# Altium project Meshtastic.PrjPcb
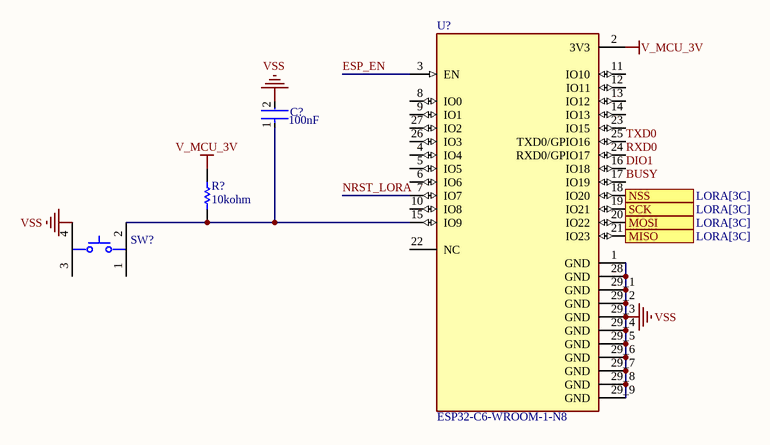
[diagram p0: ESP32.SchDoc]
4 sheets, 51 parts. Net scope: flat (ports and power ports of the same name join across sheets).
Sheets:
  ESP32.SchDoc
  GPS.SchDoc
  LORA.SchDoc
  POWER.SchDoc

## Sheet ESP32.SchDoc
size A4; SheetNumber: 1; SheetTotal: 4

### Parts
(Parts that share a designator on the sheet are numbered #1, #2 ... from top to bottom, then left to right.)
C?#1  Capacitance: 100nF  [FP-CL21-IPC_B]
R?#1  Resistance: 10kohm  [RESC2013X60X35ML10T20]  (hidden comment: RC0805JR-0710KL)
SW?  TL3305CF160QG  [FP-TL3305CF160QG-MFG]  (value not drawn)
U?  ESP32-C6-WROOM-1-N8  [XCVR_ESP32-C6-WROOM-1-N8]

### Ports
MISO (out, see LORA[3C]), MOSI (in, see LORA[3C]), NSS (in, see LORA[3C]), SCK (in, see LORA[3C])

### Nets
V_MCU_3V: R?#1.2 U?.2(3V3)
VSS: C?#1.2 SW?.4 U?.1(GND) U?.28(GND) U?.29_1(GND) U?.29_2(GND) U?.29_3(GND) U?.29_4(GND) U?.29_5(GND) U?.29_6(GND) U?.29_7(GND) U?.29_8(GND) U?.29_9(GND)
BUSY: U?.17(IO19)
DIO1: U?.16(IO18)
ESP_EN: U?.3(EN)
NRST_LORA: U?.7(IO7)
RXD0: U?.24(RXD0/GPIO17)
TXD0: U?.25(TXD0/GPIO16)
NetC?#1_1: C?#1.1 R?#1.1 SW?.2 U?.15(IO9)
NetIC?#1_16: U?.21(IO23) ; port MISO
NetIC?#1_17: U?.20(IO22) ; port MOSI
NetIC?#1_18: U?.19(IO21) ; port SCK
NetIC?#1_19: U?.18(IO20) ; port NSS

Not connected (* = marked no-connect by the designer): SW? 1 3; U? 4(IO4) 5(IO5) 6(IO6) 8(IO0) 9(IO1) 10(IO8) 11(IO10) 12(IO11) 13(IO12) 14(IO13) 22(NC) 23(IO15) 26(IO3) 27(IO2)

### Library data of the parts
C?#1 = CMP-13271-004652-1: CL21 Series 0805 100nF 50V ±10% Tolerance X7R Multilayer Ceramic Chip Capacitor; Voltage Rating (DC): 50V; Packaging: Tape and Reel; Voltage Rating: 50V; Max Operating Temperature: 125°C; Width: 0.049inch; Thickness: 0.053inch; Dielectric: X7R; Construction: Flat; Series: CL; Radiation Hardening: No; Mount: Surface Mount; Length: 2mm; Contact Plating: Tin; RoHS Compliant: Yes; Case/Package: 0805; Min Operating Temperature: -55°C; Tolerance: 10%; Lead Free: Lead Free; Height: 1.25mm; Depth: 1.25mm; Package Quantity: 10000
R?#1 = CMP-2000-05025-1: Chip Resistor, 10 KOhm, +/- 5%, 0.125 W, -55 to 155 degC, 0805 (2012 Metric), RoHS, Tape and Reel; Manufacturer: Yageo; Resistor Element Type: ThickFilm; Voltage Rating: 150V; Product Range: RCSeries; SVHC: ToBeAdvised; Resistor Case Style: 0805[2012Metric]; Temperature Coefficient: ±100ppm/degC; Power Rating: 250mW; Automotive Qualification Standard: -; Datasheet Version: REV. 2, 09/2004; Packaging: CutTape; Resistance Tolerance: ±5%; MSL: MSL1-Unlimited; Manufacturer URL: http://www.yageo.com/; Datasheet URL: http://www.yageo.ru/pdf/RC0805.pdf; Package Description: 2-Pin Surface Mounted Device, Body 2 x 1.25 mm; Package Reference: 805
SW? = CMP-17879-000011-1: SWITCH TACTILE SPST-NO 50MA 12V; Actuator Type: Standard; Illumination Type: Non-Illuminated; Mechanical Life: 500000Cycles; Switch Function: Off-Mom; Switch Travel: 0.2mm; Operating Force: 160gf; Throw Configuration: SPST; Lead Free: Lead Free; Packaging: Tape and Reel; Termination: Gull Wing; Max Operating Temperature: 70°C; Min Operating Temperature: -20°C; Mount: Surface Mount
U? = ESP32-C6-WROOM-1-N8: Multiprotocol Modules ESP32-C6 module, Wi-Fi 6 in 2.4 GHz band, Bluetooth 5, Zigbee 3.0 and Thread. ESP34-WROOM Compatible - ENGINEERING SAMPLE; MF: Espressif Systems; SnapEDA_Link: https://www.snapeda.com/parts/ESP32-C6-WROOM-1-N8/Espressif+Systems/view-part/?ref=snap; Package: SMD-28 Espressif Systems; Value: *; MP: ESP32-C6-WROOM-1-N8; Check_prices: https://www.snapeda.com/parts/ESP32-C6-WROOM-1-N8/Espressif+Systems/view-part/?ref=eda

## Sheet GPS.SchDoc
size A4; SheetNumber: 2; SheetTotal: 4
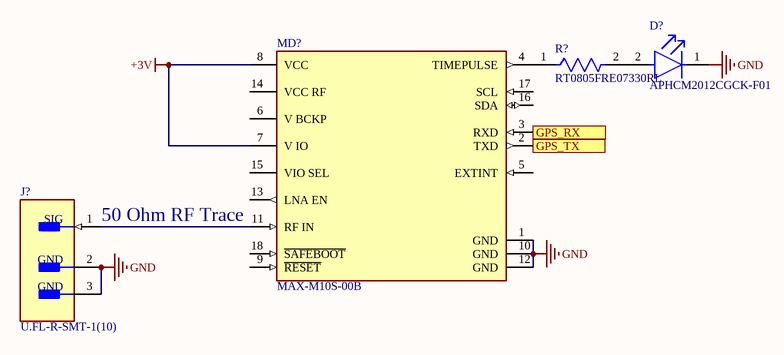
[diagram p1: GPS.SchDoc]

### Parts
(Parts that share a designator on the sheet are numbered #1, #2 ... from top to bottom, then left to right.)
D?#1  APHCM2012CGCK-F01  [FP-APHCM2012CGCK-F01-MFG]
J?#1  U.FL-R-SMT-1(10)  [FP-U_FL-R-SMT-1_10-MFG]
MD?  MAX-M10S-00B  [FP-MAX-M10S-00B-MFG]
R?#2  RT0805FRE07330RL  [FP-RT0805-MFG]

### Ports
GPS_RX (in), GPS_TX (out)

### Nets
+3V: MD?.7(V_IO) MD?.8(VCC)
GND: D?#1.1(C) J?#1.2(GND) J?#1.3(GND) MD?.1(GND) MD?.10(GND) MD?.12(GND)
NetD?#1_2: D?#1.2(A) R?#2.2
NetJ?#1_1: J?#1.1(SIG) MD?.11(RF_IN)
NetMD?_2: MD?.2(TXD) ; port GPS_TX
NetMD?_3: MD?.3(RXD) ; port GPS_RX
NetMD?_4: MD?.4(TIMEPULSE) R?#2.1

Not connected (* = marked no-connect by the designer): MD? 5(EXTINT) 6(V_BCKP) 9(~{RESET}) 13(LNA_EN) 14(VCC_RF) 15(VIO_SEL) 16(SDA) 17(SCL) 18(~{SAFEBOOT})

### Notes on the sheet
- 50 Ohm RF Trace

### Library data of the parts
D?#1 = CMP-44529-000062-1: LED GREEN CLEAR CHIP SMD; Dominant Wavelength: 570nm; Forward Current: 20mA; Number of LEDs: 1; Luminous Intensity: 40mcd; Forward Voltage: 2.1V; Viewing Angle: 110°; Illumination Color: Green; Lens Style: Clear; Mount: Surface Mount; Length: 2mm; Max Operating Temperature: 85°C; Series: APHCM; Width: 1.25mm; Lead Free: Lead Free; Wavelength: 570nm; Package Quantity: 1; Number of Pins: 2; Case Code (Metric): 2012; RoHS Compliant: Yes; Packaging: Tape and Reel; Lens Color: Clear; Case/Package: 0805; Case Code (Imperial): 0805; Test Current: 20mA; Color: Green; Min Operating Temperature: -40°C; Height: 0.4mm
J?#1 = CMP-2000-05152-3: CONN U.FL RCPT STR 50 OHM SMD; Max Frequency: 6GHz; Connector Type: Coaxial; Body Plating: Silver; Body Material: Bronze; Impedance: 50R; Dielectric Material: Polymer; Insulation Resistance: 500MR; Gender: Male; Packaging: Cut Tape; Length: 3mm; Package Quantity: 2500; Termination: Solder; Lead Free: Lead Free; Series: U.FL; Min Operating Temperature: -40°C; Fastening Type: Snap; Contact Material: Brass; Orientation: Straight; Wire/Cable Type: Coaxial; Frequency: 6GHz; Contact Plating: Gold; Depth: 3.1mm; Weight: 0.001764oz; Max Operating Temperature: 90°C; Radiation Hardening: No; REACH SVHC: No SVHC; Mount: Surface Mount; Housing Color: Beige
MD? = CMP-207130-000026-1: GNSS LCC RX, ROM, TCXO, LNA, SAW
R?#2 = CMP-03412-000042-1: Res Thin Film 0805 330K Ohm 1% 1/8W ±50ppm/°C Molded SMD SMD Paper T/R; Manufacturer: Yageo; Resistance: 330Ω; Value: 330Ω; Power Rating: 0.125W; Tolerance: 0.0001; Voltage Rating: 150V; Manufacturer Part Number: RT0805FRE07330RL; Height: 0.6mm; Octopart: https://octopart.com/rt0805fre07330rl-yageo-39785396; Package: RT0805; Temperature: -55°C to +155°C; Category: Res; RoHS: TRUE; ComponentLink2Description: Datasheet; Automotive: No; Device Class L3: Chip SMD Resistors; Temperature Range High: +155°C; Device Class L1: Passive Components; Temperature Coefficient: 50 ppm/°C; Series: RT; Composition: Thin Film; Digikey Description: Res Thin Film 0805 330K Ohm 1% 1/8W ±50ppm/°C Molded SMD SMD Paper T/R; Mouser Description: Res Thin Film 0805 330K Ohm 1% 1/8W ±50ppm/°C Molded SMD SMD Paper T/R; Device Class L2: Resistors; Temperature Range Low: -55°C; Ipc Land Pattern Name: RESC200125X50; Lead Free: Yes; ComponentLink2URL: http://www.yageo.com/documents/recent/PYu-RT_1-to-0.01_RoHS_L_9.pdf; Footprint Url: http://www.yageo.com/exep/pages/download/literatures/PYu-R_Mount_10.pdf

## Sheet LORA.SchDoc
size A4; SheetNumber: 3; SheetTotal: 4
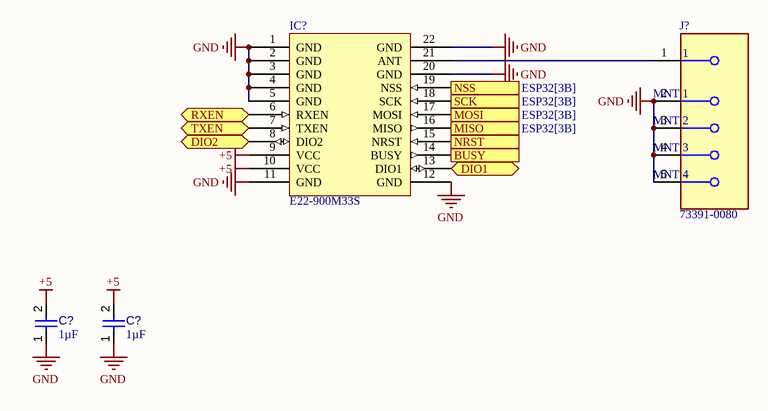
[diagram p2: LORA.SchDoc]

### Parts
(Parts that share a designator on the sheet are numbered #1, #2 ... from top to bottom, then left to right.)
C?#2  value 1µF  [CAPC2013X135X45NL10T25]  (hidden comment: Capacitor 1 uF +/- 10% 50 V 0805)
C?#3  value 1µF  [CAPC2013X135X45NL10T25]  (hidden comment: Capacitor 1 uF +/- 10% 50 V 0805)
IC?#1  E22-900M33S  [E22-XXXM33S]
J?#2  73391-0080  [FP-73391-0080-MFG]

### Ports
BUSY (out), DIO1 (bidir), DIO2 (bidir), MISO (out, see ESP32[3B]), MOSI (in, see ESP32[3B]), NRST (in), NSS (in, see ESP32[3B]), RXEN (bidir), SCK (in, see ESP32[3B]), TXEN (bidir)

### Nets
+5: C?#2.2 C?#3.2 IC?#1.9(VCC) IC?#1.10(VCC)
GND: C?#2.1 C?#3.1 IC?#1.1(GND) IC?#1.2(GND) IC?#1.3(GND) IC?#1.4(GND) IC?#1.5(GND) IC?#1.11(GND) IC?#1.12(GND) IC?#1.20(GND) IC?#1.22(GND) J?#2.2(MNT_1) J?#2.3(MNT_2) J?#2.4(MNT_3) J?#2.5(MNT_4)
NetIC?#1_6: IC?#1.6(RXEN) ; port RXEN
NetIC?#1_7: IC?#1.7(TXEN) ; port TXEN
NetIC?#1_8: IC?#1.8(DIO2) ; port DIO2
NetIC?#1_13: IC?#1.13(DIO1) ; port DIO1
NetIC?#1_14: IC?#1.14(BUSY) ; port BUSY
NetIC?#1_15: IC?#1.15(NRST) ; port NRST
NetIC?#1_16: IC?#1.16(MISO) ; port MISO
NetIC?#1_17: IC?#1.17(MOSI) ; port MOSI
NetIC?#1_18: IC?#1.18(SCK) ; port SCK
NetIC?#1_19: IC?#1.19(NSS) ; port NSS
NetIC?#1_21: IC?#1.21(ANT) J?#2.1

### Library data of the parts
C?#2 C?#3 = CMP-001-00007-6: Chip Capacitor, 1 uF, +/- 10%, 50 V, 0805 (2012 Metric); Capacitor Type: Ceramic; Voltage Rating: 50V; Min Operating Temperature: -55°C; RoHS Compliant: True; Mounting Technology: SM; Case/Package: 0805; Max Operating Temperature: 125°C; Tolerance: 10%; Pins: 2
J?#2 = CMP-00257-00776539-1: 73391-0080 RF Connector, SMA RA JACK PCB 73391 SMA RF Connectors Series; Manufacturer Lifecycle Status: ACTIVE; NexarPartId: 776539; Max Frequency: 18GHz; Polarity: Standard; Impedance: 50Ω; Connector Type: Coaxial, SMA; Body Material: Zinc; Body Plating: Nickel; REACH SVHC: Unknown; Contact Plating: Gold; Radiation Hardening: No; Mount: Through Hole; Depth: 6.35mm; Length: 14.8mm; Case/Package: SMA; Lifecycle Status: Production; Contact Material: Copper; Orientation: Right Angle; Termination: Solder; Insulation Material: Teflon; Frequency: 18GHz; RoHS: Compliant; Country of Origin: TW; Halogen Free: Low Halogen; Plating: Nickel

## Sheet POWER.SchDoc
size A4; SheetNumber: 4; SheetTotal: 4
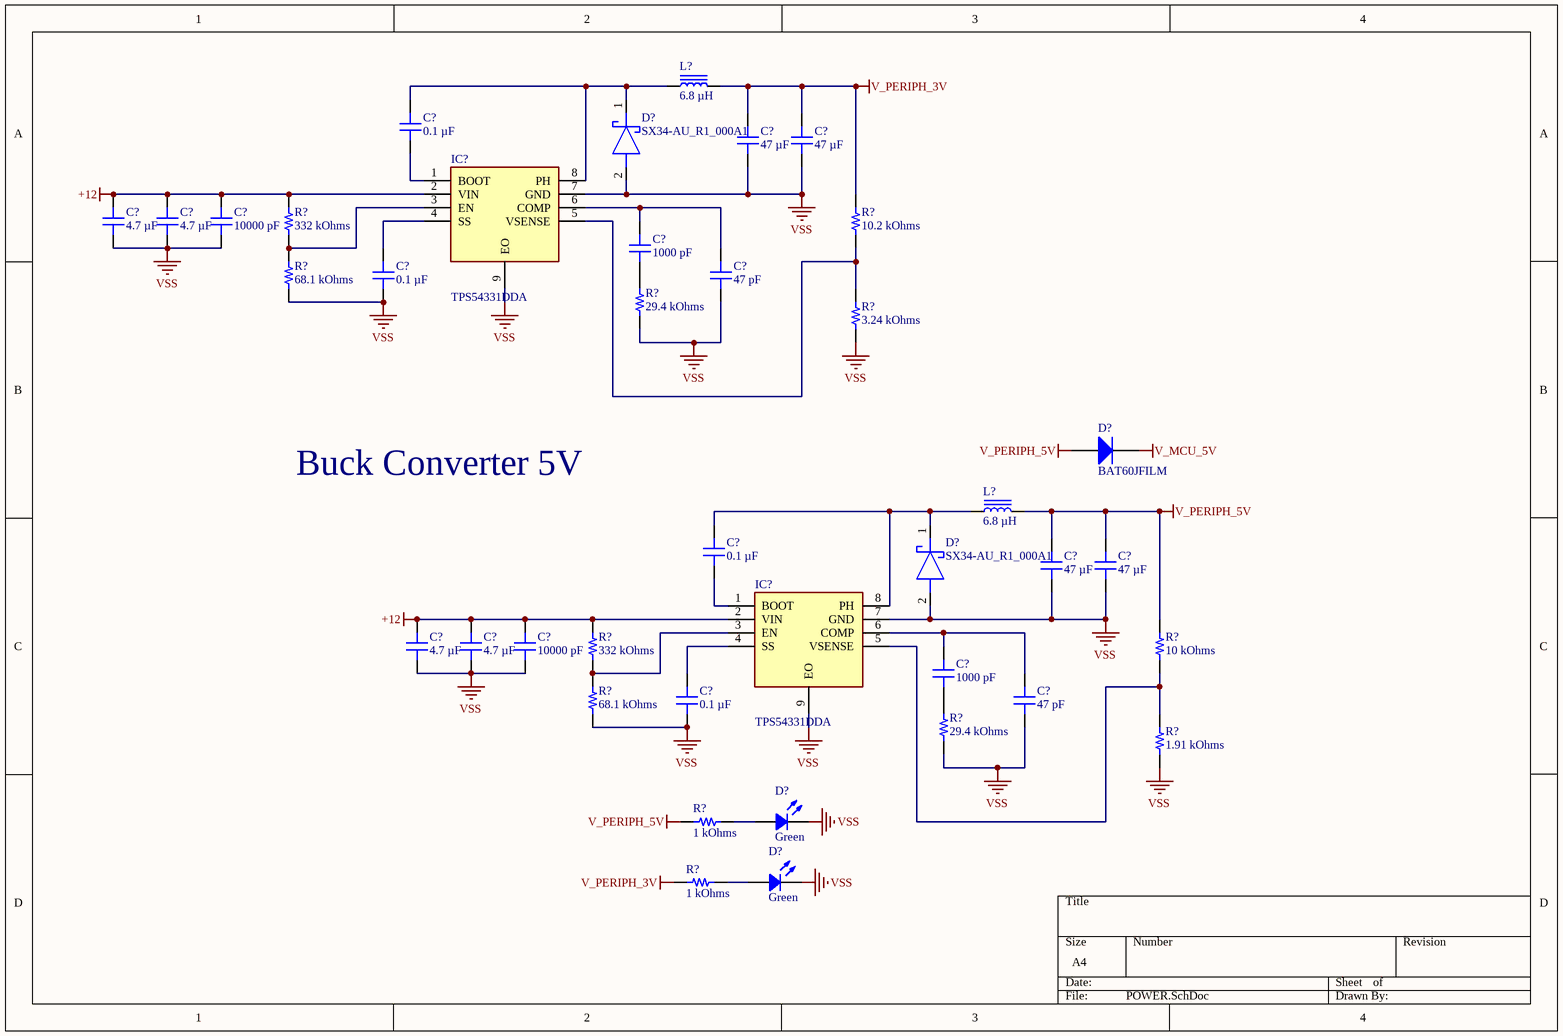
[diagram p3: POWER.SchDoc]

### Parts
(Parts that share a designator on the sheet are numbered #1, #2 ... from top to bottom, then left to right.)
C?#4  0.1 µF  [CAP 1206_3216 - 0.8MM]
C?#5  47 µF  [CAP 1206_3216 - 0.8MM]
C?#6  47 µF  [CAP 1206_3216 - 0.8MM]
C?#7  4.7 µF  [CAP 1206_3216 - 0.8MM]
C?#8  4.7 µF  [CAP 1206_3216 - 0.8MM]
C?#9  10000 pF  [CAP 1206_3216 - 0.8MM]
C?#10  1000 pF  [CAP 1206_3216 - 0.8MM]
C?#11  0.1 µF  [CAP 1206_3216 - 0.8MM]
C?#12  47 pF  [CAP 1206_3216 - 0.8MM]
C?#13  0.1 µF  [CAP 1206_3216 - 0.8MM]
C?#14  47 µF  [CAP 1206_3216 - 0.8MM]
C?#15  47 µF  [CAP 1206_3216 - 0.8MM]
C?#16  4.7 µF  [CAP 1206_3216 - 0.8MM]
C?#17  4.7 µF  [CAP 1206_3216 - 0.8MM]
C?#18  10000 pF  [CAP 1206_3216 - 0.8MM]
C?#19  1000 pF  [CAP 1206_3216 - 0.8MM]
C?#20  0.1 µF  [CAP 1206_3216 - 0.8MM]
C?#21  47 pF  [CAP 1206_3216 - 0.8MM]
D?#2  SX34-AU_R1_000A1  [DIOM5027X244N]
D?#3  BAT60JFILM  [SOD323$2F$A]
D?#4  SX34-AU_R1_000A1  [DIOM5027X244N]
D?#5  Green  [LED 0805_2012 GREEN]
D?#6  Green  [LED 0805_2012 GREEN]
IC?#2  TPS54331DDA  [SOIC127P600X170-9N]
IC?#3  TPS54331DDA  [SOIC127P600X170-9N]
L?#1  6.8 µH  [TDK SLF10165]
L?#2  6.8 µH  [TDK SLF10165]
R?#3  332 kOhms  [RES 1206_3216]
R?#4  10.2 kOhms  [RES 1206_3216]
R?#5  68.1 kOhms  [RES 1206_3216]
R?#6  29.4 kOhms  [RES 1206_3216]
R?#7  3.24 kOhms  [RES 1206_3216]
R?#8  332 kOhms  [RES 1206_3216]
R?#9  10 kOhms  [RES 1206_3216]
R?#10  68.1 kOhms  [RES 1206_3216]
R?#11  29.4 kOhms  [RES 1206_3216]
R?#12  1.91 kOhms  [RES 1206_3216]
R?#13  1 kOhms  [RES 0805_2012]
R?#14  1 kOhms  [RES 0805_2012]

### Nets
+12: C?#7.2 C?#8.2 C?#9.2 C?#16.2 C?#17.2 C?#18.2 IC?#2.2(VIN) IC?#3.2(VIN) R?#3.2 R?#8.2
V_MCU_5V: D?#3.2(K)
V_PERIPH_3V: C?#5.2 C?#6.2 L?#1.2 R?#4.2 R?#14.2
V_PERIPH_5V: C?#14.2 C?#15.2 D?#3.1(A) L?#2.2 R?#9.2 R?#13.2
VSS: C?#5.1 C?#6.1 C?#7.1 C?#8.1 C?#9.1 C?#11.1 C?#12.1 C?#14.1 C?#15.1 C?#16.1 C?#17.1 C?#18.1 C?#20.1 C?#21.1 D?#2.2(A) D?#4.2(A) D?#5.2 D?#6.2 IC?#2.7(GND) IC?#2.9(EO) IC?#3.7(GND) IC?#3.9(EO) R?#5.1 R?#6.1 R?#7.1 R?#10.1 R?#11.1 R?#12.1
NetC?#4_1: C?#4.1 IC?#2.1(BOOT)
NetC?#4_2: C?#4.2 D?#2.1(K) IC?#2.8(PH) L?#1.1
NetC?#10_1: C?#10.1 R?#6.2
NetC?#10_2: C?#10.2 C?#12.2 IC?#2.6(COMP)
NetC?#11_2: C?#11.2 IC?#2.4(SS)
NetC?#13_1: C?#13.1 IC?#3.1(BOOT)
NetC?#13_2: C?#13.2 D?#4.1(K) IC?#3.8(PH) L?#2.1
NetC?#19_1: C?#19.1 R?#11.2
NetC?#19_2: C?#19.2 C?#21.2 IC?#3.6(COMP)
NetC?#20_2: C?#20.2 IC?#3.4(SS)
NetD?#5_1: D?#5.1 R?#13.1
NetD?#6_1: D?#6.1 R?#14.1
NetIC?#2_3: IC?#2.3(EN) R?#3.1 R?#5.2
NetIC?#2_5: IC?#2.5(VSENSE) R?#4.1 R?#7.2
NetIC?#3_3: IC?#3.3(EN) R?#8.1 R?#10.2
NetIC?#3_5: IC?#3.5(VSENSE) R?#9.1 R?#12.2

### Notes on the sheet
- Buck Converter 5V

### Library data of the parts
C?#4 C?#11 C?#13 C?#20 = C1206C104K8RACTU: CAP CER 0.1UF 10V X7R 1206; manufacturer: KEMET; Tolerance: ±10%; Part Number: C1206C104K8RACTU; Capacitance: 0.1 µF; Applications: Bypass, Decoupling; componentlink1description: Datasheet; componentlink1url: https://search.kemet.com/download/datasheet/C1206C104K8RAC7800; componentlink2description: DigiKey Link; componentlink2url: https://www.digikey.com/en/products/detail/kemet/C1206C104K8RACTU/2215080; Device Package: 1206 (3216 Metric); lastupdated: 6.04.2026 7:35:59 ÖS; Lifecycle Status: Active; Minimum Order: 1; Mounting Type: Surface Mount, MLCC; Operating Temperature: -55°C ~ 125°C; Package / Case: 1206 (3216 Metric); packaging: TapeAndReel; partid: 76594; price: 0.08; series: SMD Comm X7R; Size / Dimension: 0.126" L x 0.063" W (3.20mm x 1.60mm); Supplier 1: DigiKey; Supplier Part Number 1: 399-C1206C104K8RACTUCT-ND; Temperature Coefficient: X7R; Thickness (Max): 0.035" (0.88mm); value: 0.1 µF; Voltage - Rated: 10V
C?#5 C?#6 C?#14 C?#15 = GMC31X5R476M16NT: CAP1206 X5R 47UF 20% 16V; manufacturer: Cal-Chip Electronics, Inc.; Part Number: GMC31X5R476M16NT; Capacitance: 47 µF; Applications: General Purpose; componentlink1description: Datasheet; componentlink1url: https://88ce57.p3cdn1.secureserver.net/wp-content/uploads/2023/01/gmc_series-2.pdf; componentlink2description: DigiKey Link; componentlink2url: https://www.digikey.com/en/products/detail/cal-chip-electronics-inc/GMC31X5R476M16NT/18151145; Device Package: 1206 (3216 Metric); lastupdated: 6.04.2026 7:36:39 ÖS; Lifecycle Status: Active; Minimum Order: 1; Mounting Type: Surface Mount, MLCC; Operating Temperature: -55°C ~ 85°C; Package / Case: 1206 (3216 Metric); packaging: TapeAndReel; partid: 49864; Part Status: Active; price: 0.19; series: GMC; Size / Dimension: 0.126" L x 0.063" W (3.20mm x 1.60mm); Supplier 1: DigiKey; Supplier Part Number 1: 4713-GMC31X5R476M16NTCT-ND; Temperature Coefficient: X5R; Thickness (Max): 0.071" (1.80mm); Tolerance: ±20%; value: 47 µF; Voltage - Rated: 16V
C?#7 C?#8 C?#16 C?#17 = GMC31X5R475K16NT: CAP1206 X5R 4.7UF 10% 16V; manufacturer: Cal-Chip Electronics, Inc.; Part Number: GMC31X5R475K16NT; Capacitance: 4.7 µF; Applications: General Purpose; componentlink1description: Datasheet; componentlink1url: https://calchip.com/wp-content/uploads/2025/05/GMC-Series-3.pdf; componentlink2description: DigiKey Link; componentlink2url: https://www.digikey.com/en/products/detail/cal-chip-electronics-inc/GMC31X5R475K16NT/25974971; Device Package: 1206 (3216 Metric); lastupdated: 6.04.2026 7:35:39 ÖS; Lifecycle Status: Active; Minimum Order: 1; Mounting Type: Surface Mount, MLCC; Operating Temperature: -55°C ~ 85°C; Package / Case: 1206 (3216 Metric); packaging: TapeAndReel; partid: 75053; price: 0.04; series: GMC; Size / Dimension: 0.126" L x 0.063" W (3.20mm x 1.60mm); Supplier 1: DigiKey; Supplier Part Number 1: 4713-GMC31X5R475K16NTCT-ND; Temperature Coefficient: X5R; Thickness (Max): 0.075" (1.90mm); Tolerance: ±10%; value: 4.7 µF; Voltage - Rated: 16V
C?#9 C?#18 = C1206C103J4REC7210: CAP CER 1206 10NF 16V X7R 5%; manufacturer: KEMET; Part Number: C1206C103J4REC7210; Capacitance: 10000 pF; Applications: ESD Protection; componentlink1description: Datasheet; componentlink1url: https://connect.kemet.com:7667/gateway/IntelliData-ComponentDocumentation/1.0/download/datasheet/C1206C103J4REC7210; componentlink2description: DigiKey Link; componentlink2url: https://www.digikey.com/en/products/detail/kemet/C1206C103J4REC7210/8645452; Device Package: 1206 (3216 Metric); lastupdated: 6.04.2026 7:36:20 ÖS; Lifecycle Status: Active; Minimum Order: 1; Mounting Type: Surface Mount, MLCC; Operating Temperature: -55°C ~ 125°C; Package / Case: 1206 (3216 Metric); packaging: TapeAndReel; partid: 59936; price: 0.03; series: ESD SMD Comm X7R; Size / Dimension: 0.126" L x 0.063" W (3.20mm x 1.60mm); Supplier 1: DigiKey; Supplier Part Number 1: 399-C1206C103J4REC7210CT-ND; Temperature Coefficient: X7R; Thickness (Max): 0.035" (0.88mm); Tolerance: ±5%; value: 10000 pF; Voltage - Rated: 16V
C?#10 C?#19 = GMC31CG102J50NT: CAP1206 COG 1000PF 5% 50V; manufacturer: Cal-Chip Electronics, Inc.; Temperature Coefficient: C0G, NP0; Part Number: GMC31CG102J50NT; Capacitance: 1000 pF; Applications: General Purpose; componentlink2description: DigiKey Link; componentlink2url: https://www.digikey.com/en/products/detail/cal-chip-electronics-inc/GMC31CG102J50NT/25893179; Device Package: 1206 (3216 Metric); lastupdated: 6.04.2026 7:35:48 ÖS; Lifecycle Status: Active; Minimum Order: 1; Mounting Type: Surface Mount, MLCC; Operating Temperature: -55°C ~ 125°C; Package / Case: 1206 (3216 Metric); packaging: TapeAndReel; partid: 75870; price: 0.03; series: GMC; Size / Dimension: 0.126" L x 0.063" W (3.20mm x 1.60mm); Supplier 1: DigiKey; Supplier Part Number 1: 4713-GMC31CG102J50NTCT-ND; Thickness (Max): 0.039" (1.00mm); Tolerance: ±5%; value: 1000 pF; Voltage - Rated: 50V
C?#12 C?#21 = GMC31CG470J50NT: CAP1206 COG 47PF 5% 50V; manufacturer: Cal-Chip Electronics, Inc.; Temperature Coefficient: C0G, NP0; Part Number: GMC31CG470J50NT; Capacitance: 47 pF; Applications: General Purpose; componentlink1description: Datasheet; componentlink1url: https://calchip.com/wp-content/uploads/2025/05/GMC-Series-3.pdf; componentlink2description: DigiKey Link; componentlink2url: https://www.digikey.com/en/products/detail/cal-chip-electronics-inc/GMC31CG470J50NT/25951912; Device Package: 1206 (3216 Metric); lastupdated: 6.04.2026 7:35:45 ÖS; Lifecycle Status: Active; Minimum Order: 1; Mounting Type: Surface Mount, MLCC; Operating Temperature: -55°C ~ 125°C; Package / Case: 1206 (3216 Metric); packaging: TapeAndReel; partid: 75679; price: 0.02; series: GMC; Size / Dimension: 0.126" L x 0.063" W (3.20mm x 1.60mm); Supplier 1: DigiKey; Supplier Part Number 1: 4713-GMC31CG470J50NTCT-ND; Thickness (Max): 0.035" (0.90mm); Tolerance: ±5%; value: 47 pF; Voltage - Rated: 50V
D?#2 D?#4 = SX34-AU_R1_000A1: Schottky Diode; Manufacturer_Name: PANJIT; Datasheet Link: https://www.digikey.ph/en/products/detail/panjit-international-inc/SX34-AU-R1-000A1/14660431; Height: 2.44mm; Manufacturer_Part_Number: SX34-AU_R1_000A1; Mouser Part Number: 241-SX34-AU_R1_000A1; Mouser Price/Stock: https://www.mouser.co.uk/ProductDetail/Panjit/SX34-AU_R1_000A1?qs=sPbYRqrBIVmPx5DmdP6VTw%3D%3D
D?#3 = BAT60JFILM: Manuf_1: STM; Code - JEDEC: DO-214-AB; Provided: ST; Published: 8-Jun-2000; Revision: July-2002: Re-released for DXP Platform.; Publisher: Altium Limited; Order: BAT60JFILM; Manuf_Part_1: BAT60JFILM
D?#5 D?#6 = QTLP630C4TR: LED GREEN CLEAR 0805 SMD; Manufacturer: Everlight Electronics Co Ltd; Configuration: Standard; Current - Test: 20mA; Lens Color: Colorless; Lens Size: 1.40mm x 1.25mm; Lens Style: Rectangle with Flat Top; Millicandela Rating: 10mcd; Viewing Angle: 140°; Voltage - Forward (Vf) (Typ): 2.1V; Wavelength - Dominant: 570nm; Wavelength - Peak: 565nm; Part Number: QTLP630C4TR; Color: Green; ComponentLink1Description: Datasheet; ComponentLink1URL: //media.digikey.com/PDF/Data%20Sheets/Everlight%20PDFs/QTLP630-2.pdf; ComponentLink2Description: DigiKey Link; ComponentLink2URL: https://www.digikey.com/en/products/detail/everlight-electronics-co-ltd/QTLP630C4TR/2675902; Device Package: 0805 (2012 Metric); Height (Max): 1.20mm; LastUpdated: 3.06.2024 8:00:30 ÖS; Lens Transparency: Clear; Lifecycle Status: Active; Minimum Order: 1; Mounting Type: Surface Mount; Package / Case: 0805 (2012 Metric); Packaging: TapeAndReel; PartId: 240; Part Status: Active; Price: 0.05; Series: -; Size / Dimension: 2.00mm L x 1.25mm W; Supplier 1: DigiKey; Supplier Part Number 1: 1080-1411-1-ND; Supplier Device Package: 0805; Value: Green
IC?#2 IC?#3 = TPS54331DDA: Integrated Circuit; Manufacturer_Name: Texas Instruments; Datasheet Link: http://www.ti.com/lit/gpn/TPS54331; Height: 1.7mm; Manufacturer_Part_Number: TPS54331DDA; Mouser Part Number: 595-TPS54331DDA; Mouser Price/Stock: https://www.mouser.co.uk/ProductDetail/Texas-Instruments/TPS54331DDA?qs=mNuCSSXMdBzo%2FVuLCE1BuQ%3D%3D; Arrow Part Number: TPS54331DDA; Arrow Price/Stock: https://www.arrow.com/en/products/tps54331dda/texas-instruments.html?utm_currency=USD&region=nac
L?#1 L?#2 = SLF10165T-6R8N4R33PF: FIXED IND 6.8UH 4.3A 18.2MOHM SM; Manufacturer: TDK Corporation; Current - Saturation: 4.6A; DC Resistance (DCR): 18.2mOhm Max; Inductance Frequency - Test: 100 kHz; Material - Core: Ferrite; Shielding: Shielded; Tolerance: ±30%; Type: Drum Core, Wirewound; Part Number: SLF10165T-6R8N4R33PF; ComponentLink1Description: Datasheet; ComponentLink1URL: https://product.tdk.com/info/en/catalog/datasheets/inductor_commercial_power_slf10165_en.pdf?ref_disty=digikey; ComponentLink2Description: DigiKey Link; ComponentLink2URL: https://www.digikey.com/en/products/detail/tdk-corporation/SLF10165T-6R8N4R33PF/2465241; Current Rating (Amps): 4.3 A; Device Package: Nonstandard; Height - Seated (Max): 0.268" (6.80mm); Inductance: 6.8 µH; LastUpdated: 12.07.2023 8:19:32 ÖS; Lifecycle Status: Active; Minimum Order: 1; Mounting Type: Surface Mount; Operating Temperature: -40°C ~ 105°C; Package / Case: Nonstandard; Packaging: TapeAndReel; PartId: 95; Part Status: Active; Price: 0.48; Series: SLF; Size / Dimension: 0.398" L x 0.398" W (10.10mm x 10.10mm); Supplier 1: DigiKey; Supplier Part Number 1: 445-6484-1-ND; Value: 6.8 µH
R?#3 R?#8 = TNPW1206332KBEEA: RES 332K OHM 0.1% 0.52W 1206; Manufacturer: Vishay Dale; Temperature Coefficient: ±25ppm/°C; Part Number: TNPW1206332KBEEA; ComponentLink1Description: Datasheet; ComponentLink1URL: http://www.vishay.com/docs/28758/tnpw_e3.pdf; ComponentLink2Description: DigiKey Link; ComponentLink2URL: https://www.digikey.com/en/products/detail/vishay-dale/TNPW1206332KBEEA/1608139; Composition: Thin Film; Device Package: 1206 (3216 Metric); Features: Anti-Sulfur, Automotive AEC-Q200, Moisture Resistant; Height - Seated (Max): 0.026" (0.65mm); LastUpdated: 6.04.2026 8:00:10 ÖS; Lifecycle Status: Active; Minimum Order: 1; Number of Terminations: 2; Operating Temperature: -55°C ~ 175°C; Package / Case: 1206 (3216 Metric); Packaging: TapeAndReel; PartId: 35136; Part Status: Active; Power (Watts): 0.52W; Price: 0.19; Ratings: AEC-Q200; Resistance: 332 kOhms; Series: TNPW e3; Size / Dimension: 0.126" L x 0.063" W (3.20mm x 1.60mm); Supplier 1: DigiKey; Supplier Part Number 1: 541-3235-1-ND; Supplier Device Package: 1206; Tolerance: ±0.1%; Value: 332 kOhms
R?#4 = RC1206FR-0710K2L: RES 10.2K OHM 1% 1/4W 1206; Manufacturer: Yageo; Power (Watts): 0.25W, 1/4W; Temperature Coefficient: ±100ppm/°C; Part Number: RC1206FR-0710K2L; ComponentLink1Description: Datasheet; ComponentLink1URL: https://www.yageo.com/upload/media/product/productsearch/datasheet/rchip/PYu-RC_Group_51_RoHS_L_10.pdf; ComponentLink2Description: DigiKey Link; ComponentLink2URL: https://www.digikey.com/en/products/detail/yageo/RC1206FR-0710K2L/728486; Composition: Thick Film; Device Package: 1206 (3216 Metric); Features: Moisture Resistant; Height - Seated (Max): 0.026" (0.65mm); LastUpdated: 6.04.2026 8:00:25 ÖS; Lifecycle Status: Active; Minimum Order: 1; Number of Terminations: 2; Operating Temperature: -55°C ~ 155°C; Package / Case: 1206 (3216 Metric); Packaging: TapeAndReel; PartId: 32370; Part Status: Active; Price: 0.01; Resistance: 10.2 kOhms; Series: RC_L; Size / Dimension: 0.122" L x 0.063" W (3.10mm x 1.60mm); Supplier 1: DigiKey; Supplier Part Number 1: 311-10.2KFRCT-ND; Supplier Device Package: 1206; Tolerance: ±1%; Value: 10.2 kOhms
R?#5 R?#10 = TNPW120668K1BEEN: RES 68.1K OHM 0.1% 0.52W 1206; Manufacturer: Vishay Dale; Temperature Coefficient: ±25ppm/°C; Part Number: TNPW120668K1BEEN; ComponentLink1Description: Datasheet; ComponentLink1URL: http://www.vishay.com/docs/28758/tnpw_e3.pdf; ComponentLink2Description: DigiKey Link; ComponentLink2URL: https://www.digikey.com/en/products/detail/vishay-dale/TNPW120668K1BEEN/1611271; Composition: Thin Film; Device Package: 1206 (3216 Metric); Features: Anti-Sulfur, Automotive AEC-Q200, Moisture Resistant; Height - Seated (Max): 0.026" (0.65mm); LastUpdated: 6.04.2026 8:00:01 ÖS; Lifecycle Status: Active; Minimum Order: 1; Number of Terminations: 2; Operating Temperature: -55°C ~ 175°C; Package / Case: 1206 (3216 Metric); Packaging: TapeAndReel; PartId: 36984; Part Status: Active; Power (Watts): 0.52W; Price: 0.30; Ratings: AEC-Q200; Resistance: 68.1 kOhms; Series: TNPW e3; Size / Dimension: 0.126" L x 0.063" W (3.20mm x 1.60mm); Supplier 1: DigiKey; Supplier Part Number 1: 541-3887-1-ND; Supplier Device Package: 1206; Tolerance: ±0.1%; Value: 68.1 kOhms
R?#6 R?#11 = TNPW120629K4BEEN: RES 29.4K OHM 0.1% 0.52W 1206; Manufacturer: Vishay Dale; Temperature Coefficient: ±25ppm/°C; Part Number: TNPW120629K4BEEN; ComponentLink1Description: Datasheet; ComponentLink1URL: https://www.vishay.com/docs/28758/tnpw_e3.pdf; ComponentLink2Description: DigiKey Link; ComponentLink2URL: https://www.digikey.com/en/products/detail/vishay-dale/TNPW120629K4BEEN/1611226; Composition: Thin Film; Device Package: 1206 (3216 Metric); Features: Anti-Sulfur, Automotive AEC-Q200, Moisture Resistant; Height - Seated (Max): 0.026" (0.65mm); LastUpdated: 6.04.2026 7:56:48 ÖS; Lifecycle Status: Active; Minimum Order: 1; Number of Terminations: 2; Operating Temperature: -55°C ~ 175°C; Package / Case: 1206 (3216 Metric); Packaging: TapeAndReel; PartId: 91490; Power (Watts): 0.52W; Price: 0.30; Ratings: AEC-Q200; Resistance: 29.4 kOhms; Series: TNPW e3; Size / Dimension: 0.126" L x 0.063" W (3.20mm x 1.60mm); Supplier 1: DigiKey; Supplier Part Number 1: 541-TNPW120629K4BEENCT-ND; Supplier Device Package: 1206; Tolerance: ±0.1%; Value: 29.4 kOhms
R?#7 = 3503G2B3K24FTD: RES 3.24K OHM 1% 2W 1206; Manufacturer: TE Connectivity Passive Product; Temperature Coefficient: ±50ppm/°C; Part Number: 3503G2B3K24FTD; ComponentLink1Description: Datasheet; ComponentLink1URL: https://www.te.com/commerce/DocumentDelivery/DDEController?Action=showdoc&DocId=Customer+Drawing%7F2176527%7FA%7Fpdf%7FEnglish%7FENG_CD_2176527_A.pdf%7F7-2176527-5; ComponentLink2Description: DigiKey Link; ComponentLink2URL: https://www.digikey.com/en/products/detail/te-connectivity-passive-product/3503G2B3K24FTD/16808892; Composition: Thin Film; Device Package: 1206 (3216 Metric); Height - Seated (Max): 0.023" (0.58mm); LastUpdated: 6.04.2026 7:58:43 ÖS; Lifecycle Status: Active; Minimum Order: 1; Number of Terminations: 2; Operating Temperature: -55°C ~ 155°C; Package / Case: 1206 (3216 Metric); Packaging: TapeAndReel; PartId: 72203; Part Status: Active; Power (Watts): 2W; Price: 0.46; Resistance: 3.24 kOhms; Series: 3503; Size / Dimension: 0.120" L x 0.061" W (3.05mm x 1.55mm); Supplier 1: DigiKey; Supplier Part Number 1: 1712-3503G2B3K24FTDCT-ND; Supplier Device Package: 1206; Tolerance: ±1%; Value: 3.24 kOhms
R?#9 = RS73F2BTTD1002B: RES 10K OHM 0.1% 1/3W 1206; Manufacturer: KOA Speer Electronics, Inc.; Power (Watts): 0.333W, 1/3W; Temperature Coefficient: ±25ppm/°C; Part Number: RS73F2BTTD1002B; ComponentLink1Description: Datasheet; ComponentLink1URL: https://www.koaspeer.com/pdfs/RS73.pdf; ComponentLink2Description: DigiKey Link; ComponentLink2URL: https://www.digikey.com/en/products/detail/koa-speer-electronics-inc/RS73F2BTTD1002B/11583082; Composition: Thick Film; Device Package: 1206 (3216 Metric); Features: Automotive AEC-Q200, Moisture Resistant; Height - Seated (Max): 0.028" (0.70mm); LastUpdated: 6.04.2026 7:57:45 ÖS; Lifecycle Status: Active; Minimum Order: 1; Number of Terminations: 2; Operating Temperature: -55°C ~ 155°C; Package / Case: 1206 (3216 Metric); Packaging: TapeAndReel; PartId: 84095; Price: 0.12; Ratings: AEC-Q200; Resistance: 10 kOhms; Series: RS73; Size / Dimension: 0.126" L x 0.063" W (3.20mm x 1.60mm); Supplier 1: DigiKey; Supplier Part Number 1: 2019-RS73F2BTTD1002BCT-ND; Supplier Device Package: 1206; Tolerance: ±0.1%; Value: 10 kOhms
R?#12 = 3503G2B1K91FTD: RES 1.91K OHM 1% 2W 1206; Manufacturer: TE Connectivity Passive Product; Temperature Coefficient: ±50ppm/°C; Part Number: 3503G2B1K91FTD; ComponentLink1Description: Datasheet; ComponentLink1URL: https://www.te.com/commerce/DocumentDelivery/DDEController?Action=showdoc&DocId=Customer+Drawing%7F2176527%7FA%7Fpdf%7FEnglish%7FENG_CD_2176527_A.pdf%7F5-2176527-3; ComponentLink2Description: DigiKey Link; ComponentLink2URL: https://www.digikey.com/en/products/detail/te-connectivity-passive-product/3503G2B1K91FTD/16808641; Composition: Thin Film; Device Package: 1206 (3216 Metric); Height - Seated (Max): 0.023" (0.58mm); LastUpdated: 6.04.2026 7:58:43 ÖS; Lifecycle Status: Active; Minimum Order: 1; Number of Terminations: 2; Operating Temperature: -55°C ~ 155°C; Package / Case: 1206 (3216 Metric); Packaging: TapeAndReel; PartId: 72209; Part Status: Active; Power (Watts): 2W; Price: 0.46; Resistance: 1.91 kOhms; Series: 3503; Size / Dimension: 0.120" L x 0.061" W (3.05mm x 1.55mm); Supplier 1: DigiKey; Supplier Part Number 1: 1712-3503G2B1K91FTDCT-ND; Supplier Device Package: 1206; Tolerance: ±1%; Value: 1.91 kOhms
R?#13 R?#14 = RCA08051K00FKEAHP: RES 1K OHM 1% 1/2W 0805; Manufacturer: Vishay Dale; Power (Watts): 0.5W, 1/2W; Temperature Coefficient: ±100ppm/°C; Part Number: RCA08051K00FKEAHP; Value: 1 kOhms; ComponentLink1Description: Datasheet; ComponentLink1URL: http://www.vishay.com/docs/20067/rcahp.pdf; ComponentLink2Description: DigiKey Link; ComponentLink2URL: https://www.digikey.com/en/products/detail/vishay-dale/RCA08051K00FKEAHP/6561246; Composition: Thick Film; Device Package: 0805 (2012 Metric); Features: Anti-Sulfur, Automotive AEC-Q200, Pulse Withstanding; Height - Seated (Max): 0.024" (0.60mm); LastUpdated: 5.04.2026 8:10:05 ÖS; Lifecycle Status: Active; Minimum Order: 1; Number of Terminations: 2; Operating Temperature: -55°C ~ 155°C; Package / Case: 0805 (2012 Metric); Packaging: TapeAndReel; PartId: 45382; Part Status: Active; Price: 0.03; Ratings: AEC-Q200; Resistance: 1 kOhms; Series: RCA-HP; Size / Dimension: 0.079" L x 0.049" W (2.00mm x 1.25mm); Supplier 1: DigiKey; Supplier Part Number 1: 541-3249-1-ND; Supplier Device Package: 0805; Tolerance: ±1%

## Nets that join several sheets
GND: GPS (6 pins), LORA (15 pins)
VSS: ESP32 (13 pins), POWER (28 pins)
NetIC?#1_16: ESP32 (U?.21), LORA (IC?#1.16)
NetIC?#1_17: ESP32 (U?.20), LORA (IC?#1.17)
NetIC?#1_18: ESP32 (U?.19), LORA (IC?#1.18)
NetIC?#1_19: ESP32 (U?.18), LORA (IC?#1.19)